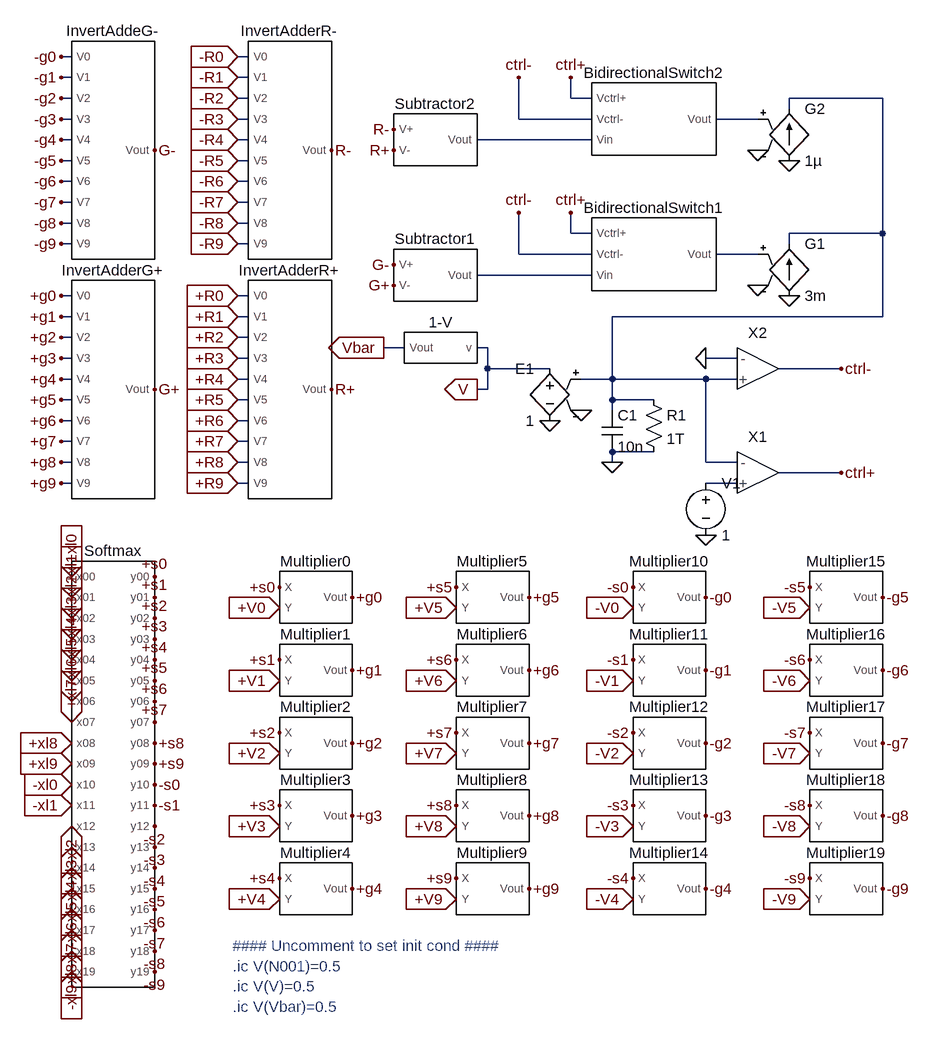
[diagram p0: schematic v_10_softmax.asc]
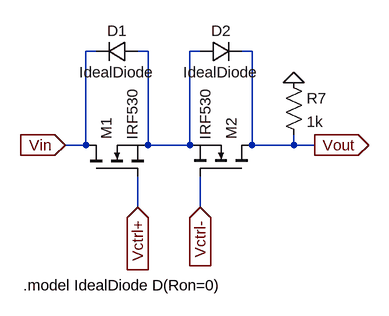
[diagram p1: sub-circuit bidirectional_switch_pm.asc]
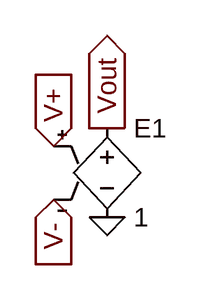
[diagram p2: sub-circuit subtractor.asc]
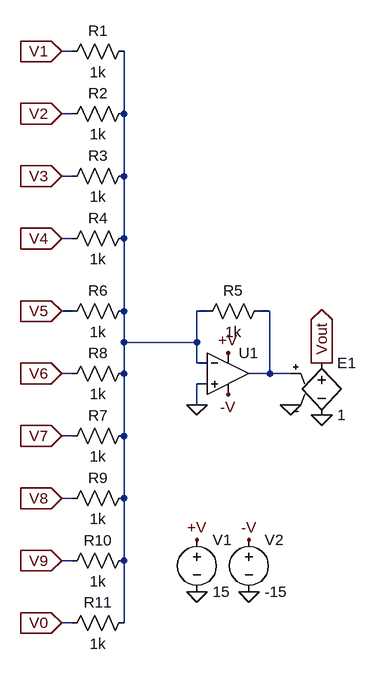
[diagram p3: sub-circuit invert_adder_10.asc]
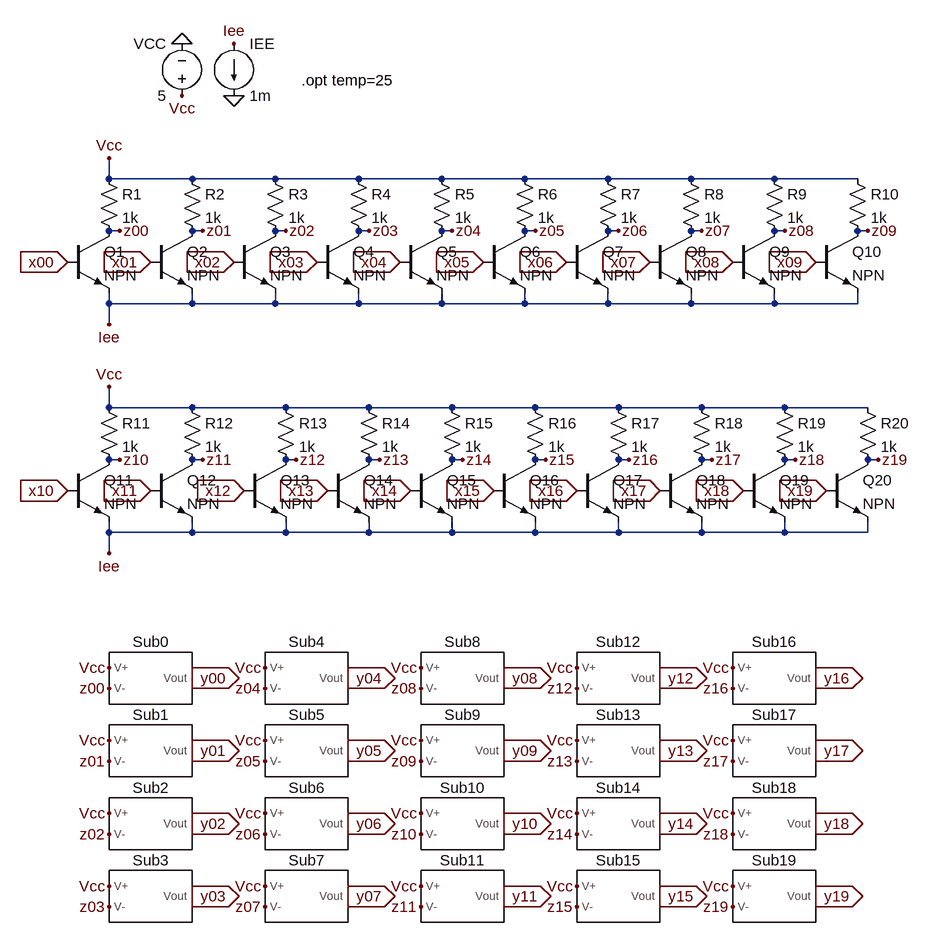
[diagram p4: sub-circuit softmax_20.asc]
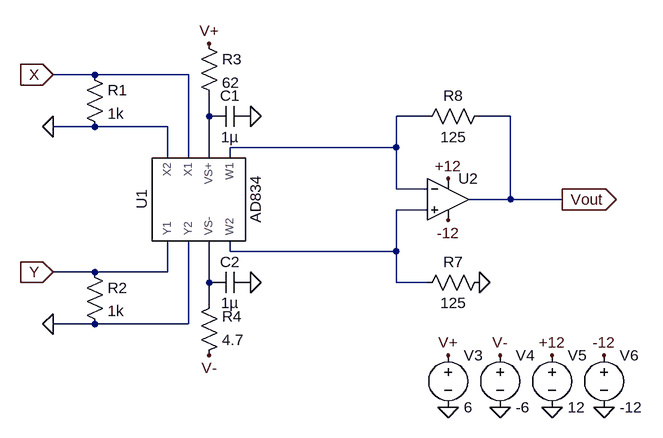
[diagram p5: sub-circuit multiplier.asc]
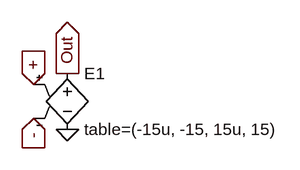
[diagram p6: sub-circuit idealopamp_15.asc]
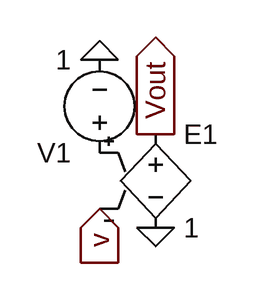
[diagram p7: sub-circuit one_minus_v.asc]
v_10_softmax.asc, the LTspice schematic file:
Version 4
SHEET 1 1076 1176
WIRE -496 -304 -512 -304
WIRE -224 -304 -240 -304
WIRE -496 -272 -512 -272
WIRE -224 -272 -240 -272
WIRE -496 -240 -512 -240
WIRE -224 -240 -240 -240
WIRE 272 -240 272 -272
WIRE 304 -240 272 -240
WIRE 752 -240 608 -240
WIRE 608 -224 608 -240
WIRE -496 -208 -512 -208
WIRE -224 -208 -240 -208
WIRE 192 -208 192 -272
WIRE 304 -208 192 -208
WIRE 560 -208 496 -208
WIRE -496 -176 -512 -176
WIRE -224 -176 -240 -176
WIRE 304 -176 128 -176
WIRE -496 -144 -512 -144
WIRE -224 -144 -240 -144
WIRE -496 -112 -512 -112
WIRE -224 -112 -240 -112
WIRE -496 -80 -512 -80
WIRE -224 -80 -240 -80
WIRE -496 -48 -512 -48
WIRE -224 -48 -240 -48
WIRE 272 -32 272 -64
WIRE 304 -32 272 -32
WIRE 752 -32 752 -240
WIRE 752 -32 608 -32
WIRE -496 -16 -512 -16
WIRE -224 -16 -240 -16
WIRE 608 -16 608 -32
WIRE 192 0 192 -64
WIRE 304 0 192 0
WIRE 560 0 496 0
WIRE 304 32 128 32
WIRE -496 64 -512 64
WIRE -224 64 -240 64
WIRE -496 96 -512 96
WIRE -224 96 -240 96
WIRE 752 96 752 -32
WIRE 752 96 336 96
WIRE -496 128 -512 128
WIRE -224 128 -240 128
WIRE 16 144 -16 144
WIRE 144 144 128 144
WIRE -496 160 -512 160
WIRE -224 160 -240 160
WIRE 528 160 480 160
WIRE 144 176 144 144
WIRE 240 176 144 176
WIRE 688 176 592 176
WIRE -496 192 -512 192
WIRE -224 192 -240 192
WIRE 336 192 336 96
WIRE 336 192 288 192
WIRE 480 192 336 192
WIRE 528 192 480 192
WIRE 144 208 144 176
WIRE 144 208 128 208
WIRE -496 224 -512 224
WIRE -224 224 -240 224
WIRE 336 224 336 192
WIRE 400 224 336 224
WIRE 336 240 336 224
WIRE -496 256 -512 256
WIRE -224 256 -240 256
WIRE -496 288 -512 288
WIRE -224 288 -240 288
WIRE 400 304 336 304
WIRE -496 320 -512 320
WIRE -224 320 -240 320
WIRE 336 320 336 304
WIRE 480 320 480 192
WIRE 528 320 480 320
WIRE 688 336 592 336
WIRE -496 352 -512 352
WIRE -224 352 -240 352
WIRE 528 352 480 352
FLAG 336 320 0
FLAG 688 176 ctrl-
FLAG 688 336 ctrl+
FLAG 480 160 0
FLAG 128 208 V
IOPIN 128 208 Out
FLAG -16 144 Vbar
IOPIN -16 144 Out
FLAG 272 -64 ctrl+
FLAG 192 -64 ctrl-
FLAG 560 48 0
FLAG 608 64 0
FLAG -496 496 +xl0
IOPIN -496 496 In
FLAG -496 528 +xl1
IOPIN -496 528 In
FLAG -496 560 +xl2
IOPIN -496 560 In
FLAG -496 592 +xl3
IOPIN -496 592 In
FLAG -496 624 +xl4
IOPIN -496 624 In
FLAG -496 656 +xl5
IOPIN -496 656 In
FLAG -496 688 +xl6
IOPIN -496 688 In
FLAG -496 720 +xl7
IOPIN -496 720 In
FLAG -496 752 +xl8
IOPIN -496 752 In
FLAG -496 784 +xl9
IOPIN -496 784 In
FLAG -496 816 -xl0
IOPIN -496 816 In
FLAG -496 848 -xl1
IOPIN -496 848 In
FLAG -496 880 -xl2
IOPIN -496 880 In
FLAG -496 912 -xl3
IOPIN -496 912 In
FLAG -496 944 -xl4
IOPIN -496 944 In
FLAG -496 976 -xl5
IOPIN -496 976 In
FLAG -496 1008 -xl6
IOPIN -496 1008 In
FLAG -496 1040 -xl7
IOPIN -496 1040 In
FLAG -496 1072 -xl8
IOPIN -496 1072 In
FLAG -496 1104 -xl9
IOPIN -496 1104 In
FLAG -368 496 +s0
FLAG -368 528 +s1
FLAG -368 560 +s2
FLAG -368 592 +s3
FLAG -368 624 +s4
FLAG -368 656 +s5
FLAG -368 688 +s6
FLAG -368 720 +s7
FLAG -368 752 +s8
FLAG -368 784 +s9
FLAG -368 816 -s0
FLAG -368 848 -s1
FLAG -368 880 -s2
FLAG -368 912 -s3
FLAG -368 944 -s4
FLAG -368 976 -s5
FLAG -368 1008 -s6
FLAG -368 1040 -s7
FLAG -368 1072 -s8
FLAG -368 1104 -s9
FLAG -176 512 +s0
FLAG -176 624 +s1
FLAG -176 736 +s2
FLAG -176 848 +s3
FLAG -176 960 +s4
FLAG 96 512 +s5
FLAG 96 624 +s6
FLAG 96 736 +s7
FLAG 96 848 +s8
FLAG 96 960 +s9
FLAG 368 512 -s0
FLAG 368 624 -s1
FLAG 368 736 -s2
FLAG 368 848 -s3
FLAG 368 960 -s4
FLAG 640 512 -s5
FLAG 640 624 -s6
FLAG 640 736 -s7
FLAG 640 848 -s8
FLAG 640 960 -s9
FLAG -176 544 +V0
IOPIN -176 544 In
FLAG -176 656 +V1
IOPIN -176 656 In
FLAG -176 768 +V2
IOPIN -176 768 In
FLAG -176 880 +V3
IOPIN -176 880 In
FLAG -176 992 +V4
IOPIN -176 992 In
FLAG 96 544 +V5
IOPIN 96 544 In
FLAG 96 656 +V6
IOPIN 96 656 In
FLAG 96 768 +V7
IOPIN 96 768 In
FLAG 96 880 +V8
IOPIN 96 880 In
FLAG 96 992 +V9
IOPIN 96 992 In
FLAG 368 544 -V0
IOPIN 368 544 In
FLAG 368 656 -V1
IOPIN 368 656 In
FLAG 368 768 -V2
IOPIN 368 768 In
FLAG 368 880 -V3
IOPIN 368 880 In
FLAG 368 992 -V4
IOPIN 368 992 In
FLAG 640 544 -V5
IOPIN 640 544 In
FLAG 640 656 -V6
IOPIN 640 656 In
FLAG 640 768 -V7
IOPIN 640 768 In
FLAG 640 880 -V8
IOPIN 640 880 In
FLAG 640 992 -V9
IOPIN 640 992 In
FLAG -64 528 +g0
FLAG -64 640 +g1
FLAG -64 752 +g2
FLAG -64 864 +g3
FLAG -64 976 +g4
FLAG 208 528 +g5
FLAG 208 640 +g6
FLAG 208 752 +g7
FLAG 208 864 +g8
FLAG 208 976 +g9
FLAG 480 528 -g0
FLAG 480 640 -g1
FLAG 480 752 -g2
FLAG 480 864 -g3
FLAG 480 976 -g4
FLAG 752 528 -g5
FLAG 752 640 -g6
FLAG 752 752 -g7
FLAG 752 864 -g8
FLAG 752 976 -g9
FLAG -512 64 +g0
FLAG -512 96 +g1
FLAG -512 128 +g2
FLAG -512 160 +g3
FLAG -512 192 +g4
FLAG -512 224 +g5
FLAG -512 256 +g6
FLAG -512 288 +g7
FLAG -512 320 +g8
FLAG -512 352 +g9
FLAG -512 -304 -g0
FLAG -512 -272 -g1
FLAG -512 -240 -g2
FLAG -512 -208 -g3
FLAG -512 -176 -g4
FLAG -512 -144 -g5
FLAG -512 -112 -g6
FLAG -512 -80 -g7
FLAG -512 -48 -g8
FLAG -512 -16 -g9
FLAG 272 -272 ctrl+
FLAG 192 -272 ctrl-
FLAG 560 -160 0
FLAG 608 -144 0
FLAG -368 208 G+
FLAG 0 48 G+
FLAG -368 -160 G-
FLAG 0 16 G-
FLAG -240 64 +R0
IOPIN -240 64 In
FLAG -240 96 +R1
IOPIN -240 96 In
FLAG -240 128 +R2
IOPIN -240 128 In
FLAG -240 160 +R3
IOPIN -240 160 In
FLAG -240 192 +R4
IOPIN -240 192 In
FLAG -240 224 +R5
IOPIN -240 224 In
FLAG -240 256 +R6
IOPIN -240 256 In
FLAG -240 288 +R7
IOPIN -240 288 In
FLAG -240 320 +R8
IOPIN -240 320 In
FLAG -240 352 +R9
IOPIN -240 352 In
FLAG -240 -304 -R0
IOPIN -240 -304 In
FLAG -240 -272 -R1
IOPIN -240 -272 In
FLAG -240 -240 -R2
IOPIN -240 -240 In
FLAG -240 -208 -R3
IOPIN -240 -208 In
FLAG -240 -176 -R4
IOPIN -240 -176 In
FLAG -240 -144 -R5
IOPIN -240 -144 In
FLAG -240 -112 -R6
IOPIN -240 -112 In
FLAG -240 -80 -R7
IOPIN -240 -80 In
FLAG -240 -48 -R8
IOPIN -240 -48 In
FLAG -240 -16 -R9
IOPIN -240 -16 In
FLAG -96 208 R+
FLAG 0 -160 R+
FLAG -96 -160 R-
FLAG 0 -192 R-
FLAG 288 240 0
FLAG 240 256 0
FLAG 480 432 0
SYMBOL cap 320 240 R0
SYMATTR InstName C1
SYMATTR Value 10n
SYMBOL bidirectional_switch_pm 400 0 R0
SYMATTR InstName BidirectionalSwitch1
SYMBOL subtractor 64 32 R0
SYMATTR InstName Subtractor1
SYMBOL g 608 -32 R0
SYMATTR InstName G1
SYMATTR Value 3m
SYMBOL invert_adder_10 -432 208 R0
SYMATTR InstName InvertAdderG+
SYMBOL invert_adder_10 -432 -160 R0
SYMATTR InstName InvertAddeG-
SYMBOL softmax_20 -432 800 R0
SYMATTR InstName Softmax
SYMBOL multiplier -128 528 R0
SYMATTR InstName Multiplier0
SYMBOL multiplier -128 640 R0
SYMATTR InstName Multiplier1
SYMBOL multiplier -128 752 R0
SYMATTR InstName Multiplier2
SYMBOL multiplier -128 864 R0
SYMATTR InstName Multiplier3
SYMBOL multiplier -128 976 R0
SYMATTR InstName Multiplier4
SYMBOL multiplier 144 528 R0
SYMATTR InstName Multiplier5
SYMBOL multiplier 144 640 R0
SYMATTR InstName Multiplier6
SYMBOL multiplier 144 752 R0
SYMATTR InstName Multiplier7
SYMBOL multiplier 144 864 R0
SYMATTR InstName Multiplier8
SYMBOL multiplier 144 976 R0
SYMATTR InstName Multiplier9
SYMBOL multiplier 416 528 R0
SYMATTR InstName Multiplier10
SYMBOL multiplier 416 640 R0
SYMATTR InstName Multiplier11
SYMBOL multiplier 416 752 R0
SYMATTR InstName Multiplier12
SYMBOL multiplier 416 864 R0
SYMATTR InstName Multiplier13
SYMBOL multiplier 416 976 R0
SYMATTR InstName Multiplier14
SYMBOL multiplier 688 528 R0
SYMATTR InstName Multiplier15
SYMBOL multiplier 688 640 R0
SYMATTR InstName Multiplier16
SYMBOL multiplier 688 752 R0
SYMATTR InstName Multiplier17
SYMBOL multiplier 688 864 R0
SYMATTR InstName Multiplier18
SYMBOL multiplier 688 976 R0
SYMATTR InstName Multiplier19
SYMBOL bidirectional_switch_pm 400 -208 R0
SYMATTR InstName BidirectionalSwitch2
SYMBOL subtractor 64 -176 R0
SYMATTR InstName Subtractor2
SYMBOL g 608 -240 R0
SYMATTR InstName G2
SYMATTR Value 1µ
SYMBOL invert_adder_10 -160 208 R0
SYMATTR InstName InvertAdderR+
SYMBOL invert_adder_10 -160 -160 R0
SYMATTR InstName InvertAdderR-
SYMBOL e 240 160 M0
SYMATTR InstName E1
SYMATTR Value 1
SYMBOL IdealOpAmp_15 560 336 R0
SYMATTR InstName X1
SYMBOL IdealOpAmp_15 560 176 R0
SYMATTR InstName X2
SYMBOL voltage 480 336 R0
WINDOW 123 0 0 Left 0
WINDOW 39 0 0 Left 0
SYMATTR InstName V1
SYMATTR Value 1
SYMBOL one_minus_v 80 144 M0
SYMATTR InstName 1-V
SYMBOL res 384 208 R0
SYMATTR InstName R1
SYMATTR Value 1T
TEXT -248 1064 Left 2 ;#### Uncomment to set init cond ####\n.ic V(N001)=0.5\n.ic V(V)=0.5\n.ic V(Vbar)=0.5

bidirectional_switch_pm.asc, the sub-circuit schematic file:
Version 4
SHEET 1 880 680
WIRE 96 0 80 0
WIRE 176 0 160 0
WIRE 256 0 240 0
WIRE 336 0 320 0
WIRE 80 144 80 0
WIRE 80 144 48 144
WIRE 176 144 176 0
WIRE 240 144 240 0
WIRE 240 144 176 144
WIRE 336 144 336 0
WIRE 400 144 400 128
WIRE 400 144 336 144
WIRE 432 144 400 144
WIRE 160 240 160 192
WIRE 256 240 256 192
FLAG 48 144 Vin
IOPIN 48 144 In
FLAG 432 144 Vout
IOPIN 432 144 Out
FLAG 160 240 Vctrl+
IOPIN 160 240 In
FLAG 256 240 Vctrl-
IOPIN 256 240 In
FLAG 400 48 0
SYMBOL nmos 80 192 R270
SYMATTR InstName M1
SYMATTR Value IRF530
SYMBOL nmos 336 192 M270
SYMATTR InstName M2
SYMATTR Value IRF530
SYMBOL diode 160 -16 R90
WINDOW 0 0 32 VBottom 2
WINDOW 3 32 32 VTop 2
SYMATTR InstName D1
SYMATTR Value IdealDiode
SYMBOL diode 256 16 R270
WINDOW 0 32 32 VTop 2
WINDOW 3 0 32 VBottom 2
SYMATTR InstName D2
SYMATTR Value IdealDiode
SYMBOL res 384 32 R0
SYMATTR InstName R7
SYMATTR Value 1k
TEXT -16 360 Left 2 !.model IdealDiode D(Ron=0)

subtractor.asc, the sub-circuit schematic file:
Version 4
SHEET 1 880 680
FLAG 304 144 V+
IOPIN 304 144 In
FLAG 304 192 V-
IOPIN 304 192 In
FLAG 352 128 Vout
IOPIN 352 128 Out
FLAG 352 208 0
SYMBOL e 352 112 R0
SYMATTR InstName E1
SYMATTR Value 1

invert_adder_10.asc, the sub-circuit schematic file:
Version 4
SHEET 1 880 712
WIRE -32 -352 -48 -352
WIRE -32 -256 -48 -256
WIRE 48 -256 48 -352
WIRE -32 -160 -48 -160
WIRE 48 -160 48 -256
WIRE -32 -64 -48 -64
WIRE 48 -64 48 -160
WIRE -32 48 -48 48
WIRE 48 48 48 -64
WIRE 176 48 160 48
WIRE 272 48 256 48
WIRE 48 96 48 48
WIRE 160 96 160 48
WIRE 160 96 48 96
WIRE 160 128 160 96
WIRE 176 128 160 128
WIRE -32 144 -48 144
WIRE 48 144 48 96
WIRE 272 144 272 48
WIRE 272 144 240 144
WIRE 304 144 272 144
WIRE 176 160 160 160
WIRE 160 192 160 160
WIRE -32 240 -48 240
WIRE 48 240 48 144
WIRE -32 336 -48 336
WIRE 48 336 48 240
WIRE -32 432 -48 432
WIRE 48 432 48 336
WIRE -32 528 -48 528
WIRE 48 528 48 432
FLAG -48 -352 V1
IOPIN -48 -352 In
FLAG 160 192 0
FLAG -48 -256 V2
IOPIN -48 -256 In
FLAG -48 -160 V3
IOPIN -48 -160 In
FLAG -48 -64 V4
IOPIN -48 -64 In
FLAG -48 48 V5
IOPIN -48 48 In
FLAG -48 144 V6
IOPIN -48 144 In
FLAG -48 240 V7
IOPIN -48 240 In
FLAG -48 336 V8
IOPIN -48 336 In
FLAG -48 432 V9
IOPIN -48 432 In
FLAG -48 528 V0
IOPIN -48 528 In
FLAG 160 480 0
FLAG 240 480 0
FLAG 160 400 +V
FLAG 208 112 +V
FLAG 240 400 -V
FLAG 208 176 -V
FLAG 304 192 0
FLAG 352 208 0
FLAG 352 128 Vout
IOPIN 352 128 Out
SYMBOL res 64 -368 R90
WINDOW 0 0 56 VBottom 2
WINDOW 3 32 56 VTop 2
SYMATTR InstName R1
SYMATTR Value 1k
SYMBOL res 64 -176 R90
WINDOW 0 0 56 VBottom 2
WINDOW 3 32 56 VTop 2
SYMATTR InstName R3
SYMATTR Value 1k
SYMBOL res 64 -272 R90
WINDOW 0 0 56 VBottom 2
WINDOW 3 32 56 VTop 2
SYMATTR InstName R2
SYMATTR Value 1k
SYMBOL res 64 -80 R90
WINDOW 0 0 56 VBottom 2
WINDOW 3 32 56 VTop 2
SYMATTR InstName R4
SYMATTR Value 1k
SYMBOL res 272 32 R90
WINDOW 0 0 56 VBottom 2
WINDOW 3 32 56 VTop 2
SYMATTR InstName R5
SYMATTR Value 1k
SYMBOL res 64 32 R90
WINDOW 0 0 56 VBottom 2
WINDOW 3 32 56 VTop 2
SYMATTR InstName R6
SYMATTR Value 1k
SYMBOL res 64 224 R90
WINDOW 0 0 56 VBottom 2
WINDOW 3 32 56 VTop 2
SYMATTR InstName R7
SYMATTR Value 1k
SYMBOL res 64 128 R90
WINDOW 0 0 56 VBottom 2
WINDOW 3 32 56 VTop 2
SYMATTR InstName R8
SYMATTR Value 1k
SYMBOL res 64 320 R90
WINDOW 0 0 56 VBottom 2
WINDOW 3 32 56 VTop 2
SYMATTR InstName R9
SYMATTR Value 1k
SYMBOL res 64 416 R90
WINDOW 0 0 56 VBottom 2
WINDOW 3 32 56 VTop 2
SYMATTR InstName R10
SYMATTR Value 1k
SYMBOL res 64 512 R90
WINDOW 0 0 56 VBottom 2
WINDOW 3 32 56 VTop 2
SYMATTR InstName R11
SYMATTR Value 1k
SYMBOL voltage 160 384 R0
WINDOW 123 0 0 Left 0
WINDOW 39 0 0 Left 0
SYMATTR InstName V1
SYMATTR Value 15
SYMBOL voltage 240 384 R0
WINDOW 123 0 0 Left 0
WINDOW 39 0 0 Left 0
SYMATTR InstName V2
SYMATTR Value -15
SYMBOL e 352 112 R0
SYMATTR InstName E1
SYMATTR Value 1
SYMBOL OpAmps\\UniversalOpAmp1 208 144 R0
SYMATTR InstName U1

softmax_20.asc, the sub-circuit schematic file:
Version 4
SHEET 1 3172 1196
WIRE 144 16 144 -16
WIRE 272 16 144 16
WIRE 400 16 272 16
WIRE 528 16 400 16
WIRE 656 16 528 16
WIRE 784 16 656 16
WIRE 912 16 784 16
WIRE 1040 16 912 16
WIRE 1168 16 1040 16
WIRE 1296 16 1168 16
WIRE 160 96 144 96
WIRE 288 96 272 96
WIRE 416 96 400 96
WIRE 544 96 528 96
WIRE 672 96 656 96
WIRE 800 96 784 96
WIRE 928 96 912 96
WIRE 1056 96 1040 96
WIRE 1184 96 1168 96
WIRE 1312 96 1296 96
WIRE 144 208 144 192
WIRE 272 208 272 192
WIRE 272 208 144 208
WIRE 400 208 400 192
WIRE 400 208 272 208
WIRE 528 208 528 192
WIRE 528 208 400 208
WIRE 656 208 656 192
WIRE 656 208 528 208
WIRE 784 208 784 192
WIRE 784 208 656 208
WIRE 912 208 912 192
WIRE 912 208 784 208
WIRE 1040 208 1040 192
WIRE 1040 208 912 208
WIRE 1168 208 1168 192
WIRE 1168 208 1040 208
WIRE 1296 208 1296 192
WIRE 1296 208 1168 208
WIRE 144 240 144 208
WIRE 144 368 144 336
WIRE 272 368 144 368
WIRE 416 368 272 368
WIRE 544 368 416 368
WIRE 672 368 544 368
WIRE 800 368 672 368
WIRE 928 368 800 368
WIRE 1056 368 928 368
WIRE 1184 368 1056 368
WIRE 1312 368 1184 368
WIRE 160 448 144 448
WIRE 288 448 272 448
WIRE 432 448 416 448
WIRE 560 448 544 448
WIRE 688 448 672 448
WIRE 816 448 800 448
WIRE 944 448 928 448
WIRE 1072 448 1056 448
WIRE 1200 448 1184 448
WIRE 1328 448 1312 448
WIRE 144 560 144 544
WIRE 272 560 272 544
WIRE 272 560 144 560
WIRE 416 560 416 544
WIRE 416 560 272 560
WIRE 544 560 544 544
WIRE 544 560 416 560
WIRE 672 560 672 544
WIRE 672 560 544 560
WIRE 800 560 800 544
WIRE 800 560 672 560
WIRE 928 560 928 544
WIRE 928 560 800 560
WIRE 1056 560 1056 544
WIRE 1056 560 928 560
WIRE 1184 560 1184 544
WIRE 1184 560 1056 560
WIRE 1312 560 1312 544
WIRE 1312 560 1184 560
WIRE 144 592 144 560
FLAG 336 -112 0
FLAG 256 -192 0
FLAG 80 144 x00
IOPIN 80 144 In
FLAG 208 144 x01
IOPIN 208 144 In
FLAG 336 144 x02
IOPIN 336 144 In
FLAG 160 96 z00
FLAG 288 96 z01
FLAG 416 96 z02
FLAG 144 800 z00
FLAG 272 784 y00
IOPIN 272 784 Out
FLAG 464 144 x03
IOPIN 464 144 In
FLAG 592 144 x04
IOPIN 592 144 In
FLAG 720 144 x05
IOPIN 720 144 In
FLAG 544 96 z03
FLAG 672 96 z04
FLAG 800 96 z05
FLAG 848 144 x06
IOPIN 848 144 In
FLAG 976 144 x07
IOPIN 976 144 In
FLAG 1104 144 x08
IOPIN 1104 144 In
FLAG 928 96 z06
FLAG 1056 96 z07
FLAG 1184 96 z08
FLAG 1232 144 x09
IOPIN 1232 144 In
FLAG 80 496 x10
IOPIN 80 496 In
FLAG 208 496 x11
IOPIN 208 496 In
FLAG 1312 96 z09
FLAG 160 448 z10
FLAG 288 448 z11
FLAG 352 496 x12
IOPIN 352 496 In
FLAG 480 496 x13
IOPIN 480 496 In
FLAG 608 496 x14
IOPIN 608 496 In
FLAG 432 448 z12
FLAG 560 448 z13
FLAG 688 448 z14
FLAG 736 496 x15
IOPIN 736 496 In
FLAG 864 496 x16
IOPIN 864 496 In
FLAG 992 496 x17
IOPIN 992 496 In
FLAG 816 448 z15
FLAG 944 448 z16
FLAG 1072 448 z17
FLAG 1120 496 x18
IOPIN 1120 496 In
FLAG 1248 496 x19
IOPIN 1248 496 In
FLAG 1200 448 z18
FLAG 1328 448 z19
FLAG 256 -112 Vcc
FLAG 144 336 Vcc
FLAG 144 -16 Vcc
FLAG 336 -192 Iee
FLAG 144 592 Iee
FLAG 144 240 Iee
FLAG 144 768 Vcc
FLAG 144 912 z01
FLAG 272 896 y01
IOPIN 272 896 Out
FLAG 144 880 Vcc
FLAG 144 1024 z02
FLAG 272 1008 y02
IOPIN 272 1008 Out
FLAG 144 992 Vcc
FLAG 144 1136 z03
FLAG 272 1120 y03
IOPIN 272 1120 Out
FLAG 144 1104 Vcc
FLAG 384 800 z04
FLAG 512 784 y04
IOPIN 512 784 Out
FLAG 384 768 Vcc
FLAG 384 912 z05
FLAG 512 896 y05
IOPIN 512 896 Out
FLAG 384 880 Vcc
FLAG 384 1024 z06
FLAG 512 1008 y06
IOPIN 512 1008 Out
FLAG 384 992 Vcc
FLAG 384 1136 z07
FLAG 512 1120 y07
IOPIN 512 1120 Out
FLAG 384 1104 Vcc
FLAG 624 800 z08
FLAG 752 784 y08
IOPIN 752 784 Out
FLAG 624 768 Vcc
FLAG 624 912 z09
FLAG 752 896 y09
IOPIN 752 896 Out
FLAG 624 880 Vcc
FLAG 624 1024 z10
FLAG 752 1008 y10
IOPIN 752 1008 Out
FLAG 624 992 Vcc
FLAG 624 1136 z11
FLAG 752 1120 y11
IOPIN 752 1120 Out
FLAG 624 1104 Vcc
FLAG 864 800 z12
FLAG 992 784 y12
IOPIN 992 784 Out
FLAG 864 768 Vcc
FLAG 864 912 z13
FLAG 992 896 y13
IOPIN 992 896 Out
FLAG 864 880 Vcc
FLAG 864 1024 z14
FLAG 992 1008 y14
IOPIN 992 1008 Out
FLAG 864 992 Vcc
FLAG 864 1136 z15
FLAG 992 1120 y15
IOPIN 992 1120 Out
FLAG 864 1104 Vcc
FLAG 1104 800 z16
FLAG 1232 784 y16
IOPIN 1232 784 Out
FLAG 1104 768 Vcc
FLAG 1104 912 z17
FLAG 1232 896 y17
IOPIN 1232 896 Out
FLAG 1104 880 Vcc
FLAG 1104 1024 z18
FLAG 1232 1008 y18
IOPIN 1232 1008 Out
FLAG 1104 992 Vcc
FLAG 1104 1136 z19
FLAG 1232 1120 y19
IOPIN 1232 1120 Out
FLAG 1104 1104 Vcc
SYMBOL npn 80 96 R0
SYMATTR InstName Q1
SYMBOL npn 208 96 R0
SYMATTR InstName Q2
SYMBOL npn 336 96 R0
SYMATTR InstName Q3
SYMBOL voltage 256 -96 R180
WINDOW 0 24 96 Left 2
WINDOW 3 24 16 Left 2
WINDOW 123 0 0 Left 0
WINDOW 39 0 0 Left 0
SYMATTR InstName VCC
SYMATTR Value 5
SYMBOL res 128 0 R0
SYMATTR InstName R1
SYMATTR Value 1k
SYMBOL res 256 0 R0
SYMATTR InstName R2
SYMATTR Value 1k
SYMBOL res 384 0 R0
SYMATTR InstName R3
SYMATTR Value 1k
SYMBOL current 336 -192 R0
WINDOW 123 0 0 Left 0
WINDOW 39 0 0 Left 0
SYMATTR InstName IEE
SYMATTR Value 1m
SYMBOL npn 464 96 R0
SYMATTR InstName Q4
SYMBOL npn 592 96 R0
SYMATTR InstName Q5
SYMBOL npn 720 96 R0
SYMATTR InstName Q6
SYMBOL res 512 0 R0
SYMATTR InstName R4
SYMATTR Value 1k
SYMBOL res 640 0 R0
SYMATTR InstName R5
SYMATTR Value 1k
SYMBOL res 768 0 R0
SYMATTR InstName R6
SYMATTR Value 1k
SYMBOL npn 848 96 R0
SYMATTR InstName Q7
SYMBOL npn 976 96 R0
SYMATTR InstName Q8
SYMBOL npn 1104 96 R0
SYMATTR InstName Q9
SYMBOL res 896 0 R0
SYMATTR InstName R7
SYMATTR Value 1k
SYMBOL res 1024 0 R0
SYMATTR InstName R8
SYMATTR Value 1k
SYMBOL res 1152 0 R0
SYMATTR InstName R9
SYMATTR Value 1k
SYMBOL npn 1232 96 R0
SYMATTR InstName Q10
SYMBOL npn 80 448 R0
SYMATTR InstName Q11
SYMBOL npn 208 448 R0
SYMATTR InstName Q12
SYMBOL res 1280 0 R0
SYMATTR InstName R10
SYMATTR Value 1k
SYMBOL res 128 352 R0
SYMATTR InstName R11
SYMATTR Value 1k
SYMBOL res 256 352 R0
SYMATTR InstName R12
SYMATTR Value 1k
SYMBOL npn 352 448 R0
SYMATTR InstName Q13
SYMBOL npn 480 448 R0
SYMATTR InstName Q14
SYMBOL npn 608 448 R0
SYMATTR InstName Q15
SYMBOL res 400 352 R0
SYMATTR InstName R13
SYMATTR Value 1k
SYMBOL res 528 352 R0
SYMATTR InstName R14
SYMATTR Value 1k
SYMBOL res 656 352 R0
SYMATTR InstName R15
SYMATTR Value 1k
SYMBOL npn 736 448 R0
SYMATTR InstName Q16
SYMBOL npn 864 448 R0
SYMATTR InstName Q17
SYMBOL npn 992 448 R0
SYMATTR InstName Q18
SYMBOL res 784 352 R0
SYMATTR InstName R16
SYMATTR Value 1k
SYMBOL res 912 352 R0
SYMATTR InstName R17
SYMATTR Value 1k
SYMBOL res 1040 352 R0
SYMATTR InstName R18
SYMATTR Value 1k
SYMBOL npn 1120 448 R0
SYMATTR InstName Q19
SYMBOL npn 1248 448 R0
SYMATTR InstName Q20
SYMBOL res 1168 352 R0
SYMATTR InstName R19
SYMATTR Value 1k
SYMBOL res 1296 352 R0
SYMATTR InstName R20
SYMATTR Value 1k
SYMBOL subtractor 208 784 R0
SYMATTR InstName Sub0
SYMBOL subtractor 208 896 R0
SYMATTR InstName Sub1
SYMBOL subtractor 208 1008 R0
SYMATTR InstName Sub2
SYMBOL subtractor 208 1120 R0
SYMATTR InstName Sub3
SYMBOL subtractor 448 784 R0
SYMATTR InstName Sub4
SYMBOL subtractor 448 896 R0
SYMATTR InstName Sub5
SYMBOL subtractor 448 1008 R0
SYMATTR InstName Sub6
SYMBOL subtractor 448 1120 R0
SYMATTR InstName Sub7
SYMBOL subtractor 688 784 R0
SYMATTR InstName Sub8
SYMBOL subtractor 688 896 R0
SYMATTR InstName Sub9
SYMBOL subtractor 688 1008 R0
SYMATTR InstName Sub10
SYMBOL subtractor 688 1120 R0
SYMATTR InstName Sub11
SYMBOL subtractor 928 784 R0
SYMATTR InstName Sub12
SYMBOL subtractor 928 896 R0
SYMATTR InstName Sub13
SYMBOL subtractor 928 1008 R0
SYMATTR InstName Sub14
SYMBOL subtractor 928 1120 R0
SYMATTR InstName Sub15
SYMBOL subtractor 1168 784 R0
SYMATTR InstName Sub16
SYMBOL subtractor 1168 896 R0
SYMATTR InstName Sub17
SYMBOL subtractor 1168 1008 R0
SYMATTR InstName Sub18
SYMBOL subtractor 1168 1120 R0
SYMATTR InstName Sub19
TEXT 440 -136 Left 2 !.opt temp=25

multiplier.asc, the sub-circuit schematic file:
Version 4
SHEET 1 936 680
WIRE -64 16 -128 16
WIRE 80 16 -64 16
WIRE 112 80 112 48
WIRE 448 80 400 80
WIRE 576 80 528 80
WIRE -64 96 -128 96
WIRE 48 96 -64 96
WIRE 400 128 400 80
WIRE 400 128 144 128
WIRE 48 144 48 96
WIRE 80 144 80 16
WIRE 112 144 112 80
WIRE 144 144 144 128
WIRE 400 192 400 128
WIRE 448 192 400 192
WIRE 576 208 576 80
WIRE 576 208 512 208
WIRE 656 208 576 208
WIRE 448 224 400 224
WIRE 144 288 144 272
WIRE 400 288 400 224
WIRE 400 288 144 288
WIRE -64 320 -128 320
WIRE 48 320 48 272
WIRE 48 320 -64 320
WIRE 112 336 112 272
WIRE 400 336 400 288
WIRE 448 336 400 336
WIRE 112 368 112 336
WIRE -64 400 -128 400
WIRE 80 400 80 272
WIRE 80 400 -64 400
FLAG 560 528 0
FLAG 480 528 0
FLAG 480 448 V+
FLAG 560 448 V-
FLAG -128 400 0
FLAG -128 96 0
FLAG -128 16 X
IOPIN -128 16 In
FLAG -128 320 Y
IOPIN -128 320 In
FLAG 176 80 0
FLAG 176 336 0
FLAG 112 -32 V+
FLAG 112 448 V-
FLAG 640 528 0
FLAG 720 528 0
FLAG 640 448 +12
FLAG 720 448 -12
FLAG 480 176 +12
FLAG 480 240 -12
FLAG 528 336 0
FLAG 656 208 Vout
IOPIN 656 208 Out
SYMBOL AutoGenerated\\AD834 96 208 R270
SYMATTR InstName U1
SYMBOL voltage 480 432 R0
WINDOW 123 0 0 Left 0
WINDOW 39 0 0 Left 0
SYMATTR InstName V3
SYMATTR Value 6
SYMBOL voltage 560 432 R0
WINDOW 123 0 0 Left 0
WINDOW 39 0 0 Left 0
SYMATTR InstName V4
SYMATTR Value -6
SYMBOL res -80 0 R0
SYMATTR InstName R1
SYMATTR Value 1k
SYMBOL res -80 304 R0
SYMATTR InstName R2
SYMATTR Value 1k
SYMBOL res 96 -48 R0
SYMATTR InstName R3
SYMATTR Value 62
SYMBOL cap 176 64 R90
WINDOW 0 0 32 VBottom 2
WINDOW 3 32 32 VTop 2
SYMATTR InstName C1
SYMATTR Value 1µ
SYMBOL res 96 464 M180
WINDOW 0 36 76 Left 2
WINDOW 3 36 40 Left 2
SYMATTR InstName R4
SYMATTR Value 4.7
SYMBOL cap 176 352 M270
WINDOW 0 32 32 VTop 2
WINDOW 3 0 32 VBottom 2
SYMATTR InstName C2
SYMATTR Value 1µ
SYMBOL voltage 640 432 R0
WINDOW 123 0 0 Left 0
WINDOW 39 0 0 Left 0
SYMATTR InstName V5
SYMATTR Value 12
SYMBOL voltage 720 432 R0
WINDOW 123 0 0 Left 0
WINDOW 39 0 0 Left 0
SYMATTR InstName V6
SYMATTR Value -12
SYMBOL res 544 320 R90
WINDOW 0 0 56 VBottom 2
WINDOW 3 32 56 VTop 2
SYMATTR InstName R7
SYMATTR Value 125
SYMBOL res 544 64 R90
WINDOW 0 0 56 VBottom 2
WINDOW 3 32 56 VTop 2
SYMATTR InstName R8
SYMATTR Value 125
SYMBOL OpAmps\\UniversalOpAmp1 480 208 R0
SYMATTR InstName U2
SYMATTR Value2 Avol=1Meg GBW=10g Vos=0

idealopamp_15.asc, the sub-circuit schematic file:
Version 4
SHEET 1 880 680
FLAG 208 192 0
FLAG 160 128 +
IOPIN 160 128 In
FLAG 160 176 -
IOPIN 160 176 In
FLAG 208 112 Out
IOPIN 208 112 Out
SYMBOL e 208 96 R0
SYMATTR InstName E1
SYMATTR Value table=(-15u, -15, 15u, 15)

one_minus_v.asc, the sub-circuit schematic file:
Version 4
SHEET 1 880 680
FLAG 144 176 v
IOPIN 144 176 In
FLAG 144 48 0
FLAG 192 192 0
FLAG 192 112 Vout
IOPIN 192 112 Out
SYMBOL voltage 144 144 R180
WINDOW 123 0 0 Left 0
WINDOW 39 0 0 Left 0
SYMATTR InstName V1
SYMATTR Value 1
SYMBOL e 192 96 R0
SYMATTR InstName E1
SYMATTR Value 1

The netlist it stands for:
* v_10_softmax.asc
C1 N001 0 10n
XBidirectionalSwitch1 ctrl+ ctrl- N005 N004 bidirectional_switch_pm
XSubtractor1 G- G+ N005 subtractor
G1 0 N001 N004 0 3m
XInvertAdderG+ +g0 +g1 +g2 +g3 +g4 +g5 +g6 +g7 +g8 +g9 G+ invert_adder_10
XInvertAddeG- -g0 -g1 -g2 -g3 -g4 -g5 -g6 -g7 -g8 -g9 G- invert_adder_10
XSoftmax +xl0 +xl1 +xl2 +xl3 +xl4 +xl5 +xl6 +xl7 +xl8 +xl9 -xl0 -xl1 -xl2 -xl3 -xl4 -xl5 -xl6 -xl7 -xl8 -xl9 +s0 +s1 +s2 +s3 +s4 +s5 +s6 +s7 +s8 +s9 -s0 -s1 -s2 -s3 -s4 -s5 -s6 -s7 -s8 -s9 softmax_20
XMultiplier0 +s0 +V0 +g0 multiplier
XMultiplier1 +s1 +V1 +g1 multiplier
XMultiplier2 +s2 +V2 +g2 multiplier
XMultiplier3 +s3 +V3 +g3 multiplier
XMultiplier4 +s4 +V4 +g4 multiplier
XMultiplier5 +s5 +V5 +g5 multiplier
XMultiplier6 +s6 +V6 +g6 multiplier
XMultiplier7 +s7 +V7 +g7 multiplier
XMultiplier8 +s8 +V8 +g8 multiplier
XMultiplier9 +s9 +V9 +g9 multiplier
XMultiplier10 -s0 -V0 -g0 multiplier
XMultiplier11 -s1 -V1 -g1 multiplier
XMultiplier12 -s2 -V2 -g2 multiplier
XMultiplier13 -s3 -V3 -g3 multiplier
XMultiplier14 -s4 -V4 -g4 multiplier
XMultiplier15 -s5 -V5 -g5 multiplier
XMultiplier16 -s6 -V6 -g6 multiplier
XMultiplier17 -s7 -V7 -g7 multiplier
XMultiplier18 -s8 -V8 -g8 multiplier
XMultiplier19 -s9 -V9 -g9 multiplier
XBidirectionalSwitch2 ctrl+ ctrl- N003 N002 bidirectional_switch_pm
XSubtractor2 R- R+ N003 subtractor
G2 0 N001 N002 0 1µ
XInvertAdderR+ +R0 +R1 +R2 +R3 +R4 +R5 +R6 +R7 +R8 +R9 R+ invert_adder_10
XInvertAdderR- -R0 -R1 -R2 -R3 -R4 -R5 -R6 -R7 -R8 -R9 R- invert_adder_10
E1 V 0 N001 0 1
XX1 N006 N001 ctrl+ idealopamp_15
XX2 N001 0 ctrl- idealopamp_15
V1 N006 0 1
X1-V V Vbar one_minus_v
R1 N001 0 1T

* block symbol definitions
.subckt bidirectional_switch_pm Vctrl+ Vctrl- Vin Vout
M1 Vin Vctrl+ N001 N001 IRF530
M2 Vout Vctrl- N001 N001 IRF530
D1 N001 Vin IdealDiode
D2 N001 Vout IdealDiode
R7 0 Vout 1k
.model IdealDiode D(Ron=0)
.ends bidirectional_switch_pm

.subckt subtractor V+ V- Vout
E1 Vout 0 V+ V- 1
.ends subtractor

.subckt invert_adder_10 V0 V1 V2 V3 V4 V5 V6 V7 V8 V9 Vout
R1 N001 V1 1k
R3 N001 V3 1k
R2 N001 V2 1k
R4 N001 V4 1k
R5 N002 N001 1k
R6 N001 V5 1k
R7 N001 V7 1k
R8 N001 V6 1k
R9 N001 V8 1k
R10 N001 V9 1k
R11 N001 V0 1k
V1 +V 0 15
V2 -V 0 -15
E1 Vout 0 N002 0 1
XU1 0 N001 +V -V N002 level1 Avol=1Meg GBW=10Meg Vos=0 En=0 Enk=0 In=0 Ink=0 Rin=500Meg  ; pins In+ In- V+ V- OUT
.ends invert_adder_10

.subckt softmax_20 x00 x01 x02 x03 x04 x05 x06 x07 x08 x09 x10 x11 x12 x13 x14 x15 x16 x17 x18 x19 y00 y01 y02 y03 y04 y05 y06 y07 y08 y09 y10 y11 y12 y13 y14 y15 y16 y17 y18 y19
Q1 z00 x00 Iee 0 NPN
Q2 z01 x01 Iee 0 NPN
Q3 z02 x02 Iee 0 NPN
VCC Vcc 0 5
R1 Vcc z00 1k
R2 Vcc z01 1k
R3 Vcc z02 1k
IEE Iee 0 1m
Q4 z03 x03 Iee 0 NPN
Q5 z04 x04 Iee 0 NPN
Q6 z05 x05 Iee 0 NPN
R4 Vcc z03 1k
R5 Vcc z04 1k
R6 Vcc z05 1k
Q7 z06 x06 Iee 0 NPN
Q8 z07 x07 Iee 0 NPN
Q9 z08 x08 Iee 0 NPN
R7 Vcc z06 1k
R8 Vcc z07 1k
R9 Vcc z08 1k
Q10 z09 x09 Iee 0 NPN
Q11 z10 x10 Iee 0 NPN
Q12 z11 x11 Iee 0 NPN
R10 Vcc z09 1k
R11 Vcc z10 1k
R12 Vcc z11 1k
Q13 z12 x12 Iee 0 NPN
Q14 z13 x13 Iee 0 NPN
Q15 z14 x14 Iee 0 NPN
R13 Vcc z12 1k
R14 Vcc z13 1k
R15 Vcc z14 1k
Q16 z15 x15 Iee 0 NPN
Q17 z16 x16 Iee 0 NPN
Q18 z17 x17 Iee 0 NPN
R16 Vcc z15 1k
R17 Vcc z16 1k
R18 Vcc z17 1k
Q19 z18 x18 Iee 0 NPN
Q20 z19 x19 Iee 0 NPN
R19 Vcc z18 1k
R20 Vcc z19 1k
XSub0 Vcc z00 y00 subtractor
XSub1 Vcc z01 y01 subtractor
XSub2 Vcc z02 y02 subtractor
XSub3 Vcc z03 y03 subtractor
XSub4 Vcc z04 y04 subtractor
XSub5 Vcc z05 y05 subtractor
XSub6 Vcc z06 y06 subtractor
XSub7 Vcc z07 y07 subtractor
XSub8 Vcc z08 y08 subtractor
XSub9 Vcc z09 y09 subtractor
XSub10 Vcc z10 y10 subtractor
XSub11 Vcc z11 y11 subtractor
XSub12 Vcc z12 y12 subtractor
XSub13 Vcc z13 y13 subtractor
XSub14 Vcc z14 y14 subtractor
XSub15 Vcc z15 y15 subtractor
XSub16 Vcc z16 y16 subtractor
XSub17 Vcc z17 y17 subtractor
XSub18 Vcc z18 y18 subtractor
XSub19 Vcc z19 y19 subtractor
.opt temp=25
.ends softmax_20

.subckt multiplier X Y Vout
XU1 Y 0 N004 N003 N002 N001 X 0 AD834  ; pins Y1 Y2 VS- W2 W1 VS+ X1 X2
V3 V+ 0 6
V4 V- 0 -6
R1 X 0 1k
R2 Y 0 1k
R3 V+ N001 62
C1 0 N001 1µ
R4 V- N004 4.7
C2 0 N004 1µ
V5 +12 0 12
V6 -12 0 -12
R7 0 N003 125
R8 Vout N002 125
XU2 N003 N002 +12 -12 Vout level1 Avol=1Meg GBW=10g Vos=0 En=0 Enk=0 In=0 Ink=0 Rin=500Meg  ; pins In+ In- V+ V- OUT
.ends multiplier

.subckt idealopamp_15 + - Out
E1 Out 0 + - table=(-15u, -15, 15u, 15)
.ends idealopamp_15

.subckt one_minus_v v Vout
V1 P001 0 1
E1 Vout 0 P001 v 1
.ends one_minus_v

.model D D
.lib standard.dio
.model NPN NPN
.model PNP PNP
.lib standard.bjt
.model NMOS NMOS
.model PMOS PMOS
.lib standard.mos
* #### Uncomment to set init cond ####
* .ic V(N001)=0.5
* .ic V(V)=0.5
* .ic V(Vbar)=0.5
.lib UniversalOpAmp1.lib
.lib C:\Research\Code\spice\scratches\ad834.cir
.backanno
.end